# EAGLE design design (EAGLE 9.5.2)
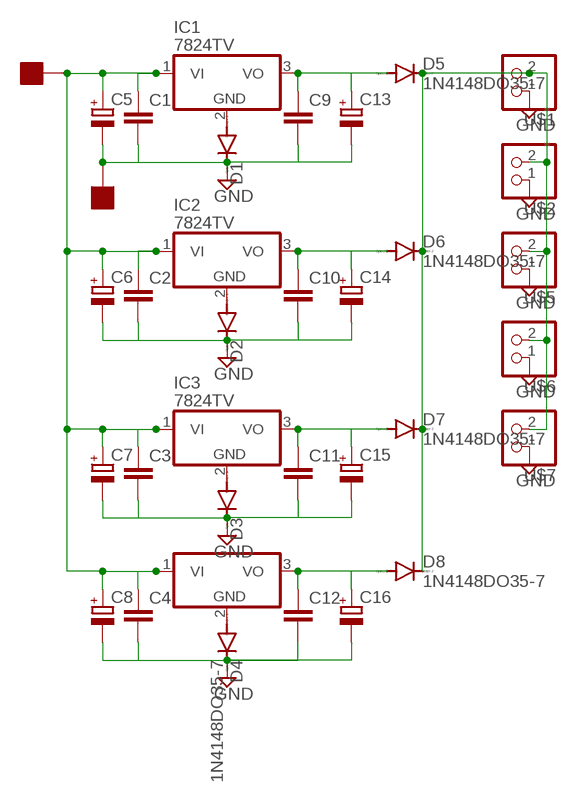
[diagram p0: schematic, sheet 1]

## Parts
C1  C-EU025-024X044  [C025-024X044]
C2  C-EU025-024X044  [C025-024X044]
C3  C-EU025-024X044  [C025-024X044]
C4  C-EU025-024X044  [C025-024X044]
C5  CPOL-EUE2.5-7  [E2,5-7]
C6  CPOL-EUE2.5-7  [E2,5-7]
C7  CPOL-EUE2.5-7  [E2,5-7]
C8  CPOL-EUE2.5-7  [E2,5-7]
C9  C-EU025-024X044  [C025-024X044]
C10  C-EU025-024X044  [C025-024X044]
C11  C-EU025-024X044  [C025-024X044]
C12  C-EU025-024X044  [C025-024X044]
C13  CPOL-EUE2.5-7  [E2,5-7]
C14  CPOL-EUE2.5-7  [E2,5-7]
C15  CPOL-EUE2.5-7  [E2,5-7]
C16  CPOL-EUE2.5-7  [E2,5-7]
D1  1N4148DO35-7  [DO35-7]
D2  1N4148DO35-7  [DO35-7]
D3  1N4148DO35-7  [DO35-7]
D4  1N4148DO35-7  [DO35-7]
D5  1N4148DO35-7  [DO35-7]
D6  1N4148DO35-7  [DO35-7]
D7  1N4148DO35-7  [DO35-7]
D8  1N4148DO35-7  [DO35-7]
IC1  7824TV  [TO220V]
IC2  7824TV  [TO220V]
IC3  7824TV  [TO220V]
IC4  7824TV  [TO220V]
U$1  ABOUTERS_2PIN  [22-23-2021]
U$2  ABOUTERS_2PIN  [22-23-2021]
U$3  PLAT10.0X10.0  [PLAT]
U$4  PLAT10.0X10.0  [PLAT]
U$5  ABOUTERS_2PIN  [22-23-2021]
U$6  ABOUTERS_2PIN  [22-23-2021]
U$7  ABOUTERS_2PIN  [22-23-2021]

## Nets
GND: C1.2 C2.2 C3.2 C4.2 C5.- C6.- C7.- C8.- C9.2 C10.2 C11.2 C12.2 C13.- C14.- C15.- C16.- D1.C D2.C D3.C D4.C U$1.1 U$2.1 U$4.P$1(RE) U$5.1 U$6.1 U$7.1
N$1: D1.A IC1.2(GND)
N$2: D2.A IC2.2(GND)
N$3: D3.A IC3.2(GND)
N$4: D4.A IC4.2(GND)
N$5: C11.1 C15.+ D7.A IC3.3(VO)
N$6: C1.1 C2.1 C3.1 C4.1 C5.+ C6.+ C7.+ C8.+ IC1.1(VI) IC2.1(VI) IC3.1(VI) IC4.1(VI) U$3.P$1(RE)
N$8: C10.1 C14.+ D6.A IC2.3(VO)
N$10: C9.1 C13.+ D5.A IC1.3(VO)
N$12: C12.1 C16.+ D8.A IC4.3(VO)
N$17: D5.C D6.C D7.C D8.C U$1.2 U$2.2 U$5.2 U$6.2 U$7.2

## Library data of the parts
C1-C4 C9-C12 = rcl:C-EU: CAPACITOR, European symbol; SPICEPREFIX: C
C5-C8 C13-C16 = rcl:CPOL-EU: POLARIZED CAPACITOR, European symbol; SPICEPREFIX: C
D1-D8 = diode:1N4148: DIODE high speed (Philips)
IC1-IC4 = linear:78*: Positive VOLTAGE REGULATOR Source: http://cache.national.com/ds/LM/LM78L05.pdf http://www.fairchildsemi.com/ds/LM/LM7805.pdf
U$1 U$2 U$5-U$7 = abouters_pin (1):ABOUTERS_2PIN
U$3 U$4 = plat10-10:PLAT10.0X10.0

## Board
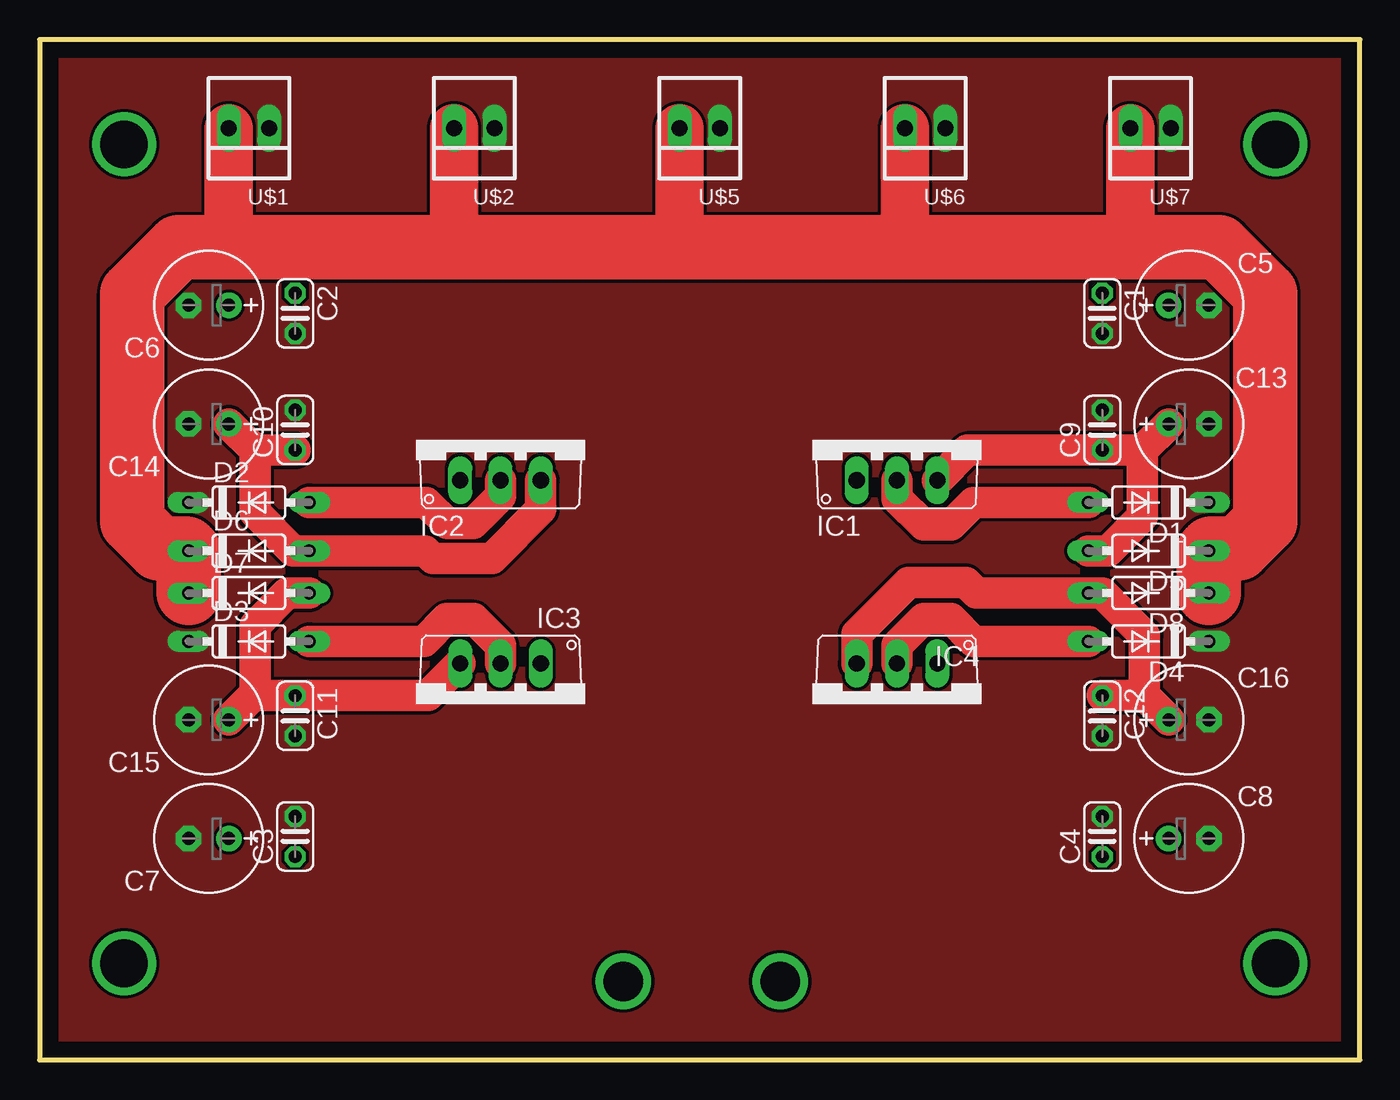
[diagram p1: board, top side]
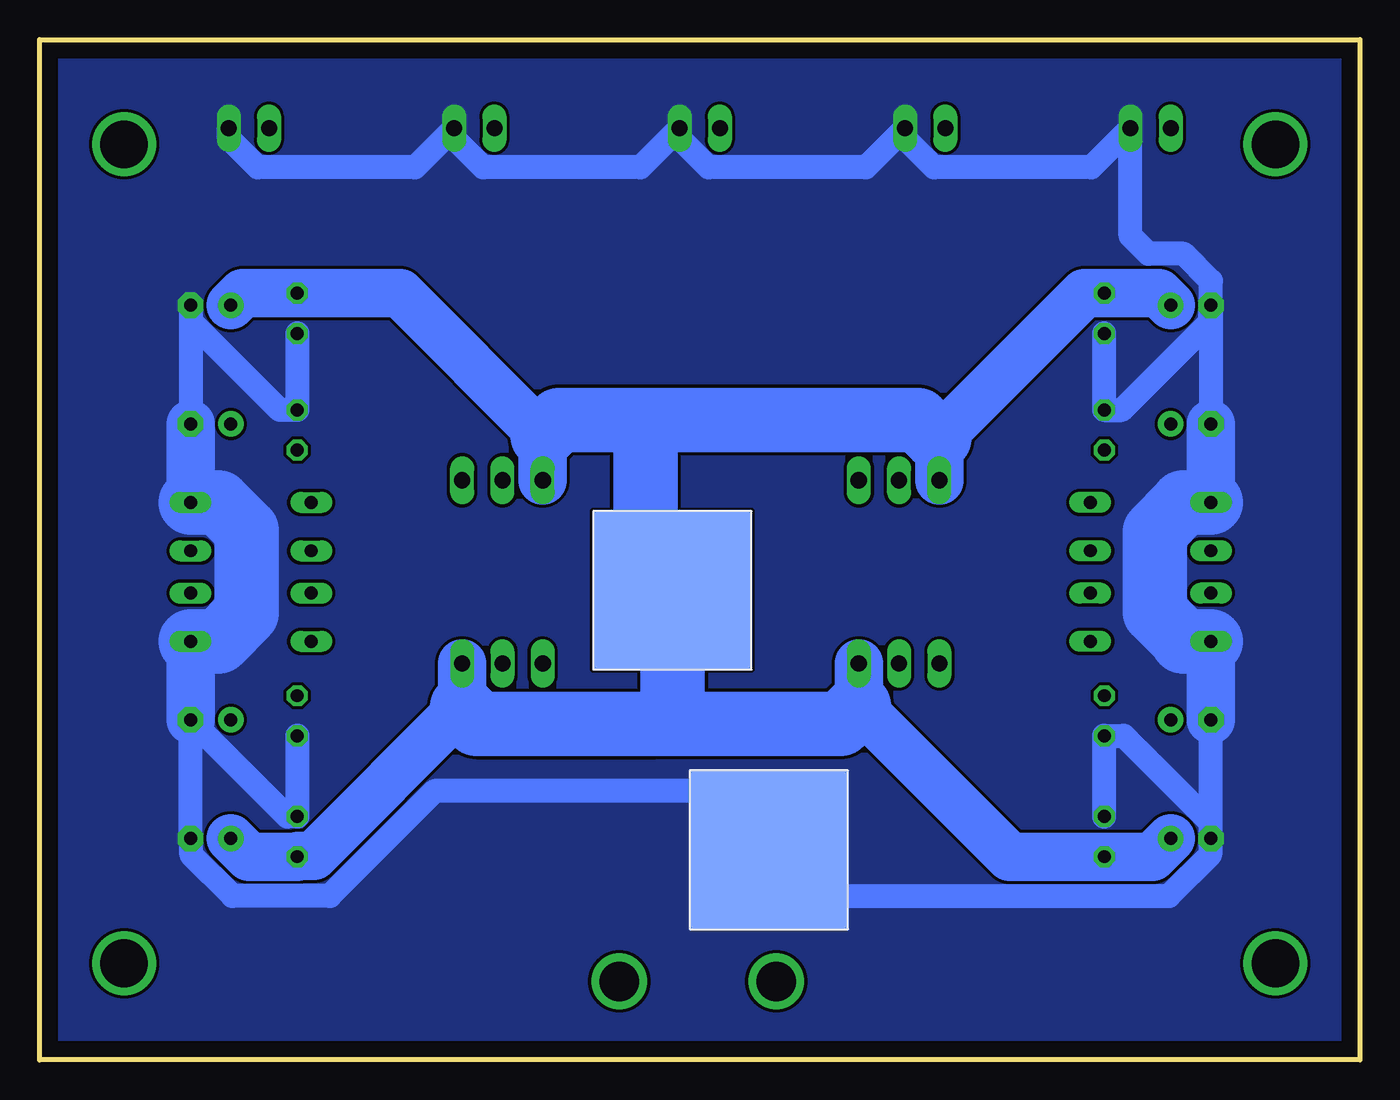
[diagram p2: board, bottom side, seen from below]

Size 83.31 x 64.39 mm. Coordinates in mm from the lower left corner, seen from the top.
Outline: 0,64.39 0,0 83.31,0 83.31,64.39 0,64.39
Copper layers (1*16): Top 0.035mm / dielectric 1.5mm / Bottom 0.035mm
Design rules "default *": minimum track width 6mil, minimum drill 0.35mm, track to track 0.2mm, track to pad 0.2mm, pad to pad 0.2mm, via to via 0.2mm, smd to smd 0.2mm, copper to edge 40mil, drill to drill 6mil, minimum pad ring 10mil, minimum via ring 8mil, stop-mask expansion 4mil, vias tented up to drill 0mil, thermal gap 10mil

### Footprints (pad centres in the part's own frame; a part is rotated, then mirrored left to right if it is on the bottom)
C025-024X044 = drill 0.813 octagon: 1 -1.27,0; 2 1.27,0
E2,5-7 = drill 0.813 pad 1.6: + -1.27,0 | drill 0.813 pad 1.6 octagon: - 1.27,0
DO35-7 = drill 0.813 long: A 3.81,0; C -3.81,0
TO220V = drill 1.016 long: 1 -2.54,-2.54; 2 0,-2.54; 3 2.54,-2.54
22-23-2021 = drill 1 long: 1 -1.27,0; 2 1.27,0
PLAT = smd 10 x 10: P$1 5,5

### Placement (x,y rotation side)
C1  67.06,47.12 270 top
C2  16.13,47.12 270 top
C3  16.13,14.1 90 top
C4  67.06,14.1 90 top
C5  72.52,47.62 0 top
C6  10.67,47.62 180 top
C7  10.67,13.97 180 top
C8  72.52,13.97 0 top
C9  67.06,39.75 90 top
C10  16.13,39.75 90 top
C11  16.13,21.72 270 top
C12  67.06,21.72 270 top
C13  72.52,40.13 0 top
C14  10.67,40.13 180 top
C15  10.67,21.46 180 top
C16  72.52,21.46 0 top
D1  69.98,35.18 180 top
D2  13.21,35.18 0 top
D3  13.21,26.42 0 top
D4  69.98,26.42 180 top
D5  69.98,32.13 180 top
D6  13.21,32.13 0 top
D7  13.21,29.46 0 top
D8  69.98,29.46 180 top
IC1  54.1,39.12 0 top
IC2  29.08,39.12 0 top
IC3  29.08,22.48 180 top
IC4  54.1,22.48 180 top
U$1  13.21,58.8 180 top
U$2  27.43,58.8 180 top
U$3  48.39,24.64 0 bottom
U$4  42.29,8.25 0 bottom
U$5  41.66,58.8 180 top
U$6  55.88,58.8 180 top
U$7  70.1,58.8 180 top

### Tracks (layer width: path | path; a pad name or v marks a point on that pad's centre or on a via)
GND
  Bottom 1.524: C15.- C7.- 9.45,13.92 | C3.2 C11.2 14.9,20.45 9.45,15 9.45,13.92 | C1.2 C9.2 68.16,41.02 73.73,46.59 73.73,47.57 C5.- C13.- | C12.2 C4.2 67.69,15.37 C16.- C8.- 73.73,13.92 73.73,12.94 71.13,10.34 65.01,10.34 58.38,16.98 41.01,16.98 U$4.P$1 34.38,10.34 12.05,10.34 9.45,12.94 9.45,13.92 | C6.- C14.- | C2.2 C10.2 15.03,41.02 9.45,46.59 9.45,47.57 C6.- | C6.- 9.4,49.15 11.12,50.87 13.34,50.87 14.48,52.02 U$1.1 16.95,56.33 26.87,56.33 28.7,58.16 U$2.1 31.17,56.33 41.1,56.33 42.93,58.16 U$5.1 45.4,56.33 55.32,56.33 57.15,58.16 U$6.1 59.62,56.33 69.54,56.33 71.37,58.16 U$7.1
  Bottom 3.048: D2.C C14.- | C15.- D3.C | C16.- D4.C | D1.C C13.-
  Bottom 4.064: D3.C 11.18,26.42 11.18,26.49 12.95,28.27 12.95,33.33 11.18,35.1 11.18,35.18 D2.C | D4.C 72.01,26.42 70.23,28.19 70.23,33.4 72.01,35.18 D1.C
  pour Top (no thermals): -0.13,64.52 -0.13,-0.13 83.44,-0.13 83.44,64.52
  pour Bottom (no thermals): -0.13,64.52 -0.13,-0.13 83.44,-0.13 83.44,64.52
N$1
  Top 2: D1.A 58.92,35.18 57.5,33.75 55.79,33.75 54.1,35.44 IC1.2
N$2
  Top 2: D2.A 24.4,35.18 25.73,33.85 27.36,33.85 29.08,35.58 IC2.2
N$3
  Top 2: D3.A 24.26,26.42 25.69,27.84 27.4,27.84 29.08,26.16 IC3.2
N$4
  Top 2: IC4.2 54.1,26.16 55.79,27.84 57.5,27.84 58.92,26.42 D4.A
N$5
  Top 2: C15.+ 13.46,22.99 | 13.46,22.99 C11.1 24.51,22.99 IC3.3 | 13.46,22.99 13.59,23.11 13.59,27.43 15.62,29.46 D7.A
N$6
  Bottom 3.048: C6.+ 12.7,48.39 C2.1 17.4,48.39 26.54,39.24 IC2.1 | C7.+ 13.08,12.83 C3.1 22.1,12.83 31.62,22.35 IC3.1 | C8.+ 70.1,12.83 C4.1 67,12.88 66.03,12.88 56.64,22.27 IC4.1 | C5.+ 70.49,48.39 C1.1 60.58,48.39 51.56,39.37 IC1.1
  Bottom 4.064: 31.62,22.35 32.77,21.21 44.45,21.21 | 26.54,39.24 26.75,39.24 27.9,40.39 45.09,40.39 | 45.09,40.39 50.55,40.39 51.56,39.37 | 44.45,21.21 55.75,21.21 55.75,21.38 56.64,22.27 | 44.45,21.21 43.39,22.27 U$3.P$1 45.09,31.34 45.09,40.39
N$7  (via drill 2.5)
  other vias: 36.83,4.95
N$8
  Top 2: C14.+ 13.59,38.48 | 13.59,38.48 C10.1 | 13.59,38.48 13.59,34.54 16,32.13 D6.A 24.34,32.13 24.82,31.65 28.55,31.65 31.62,34.72 IC2.3
N$9  (via drill 2.5)
  other vias: 46.74,4.95
N$10
  Top 2: D5.A 67.44,32.13 69.6,34.29 69.6,38.48 | IC1.3 58.55,38.48 C9.1 69.6,38.48 | C13.+ 69.6,38.48
N$11  (via drill 3)
  other vias: 5.33,6.1
N$12
  Top 2: C16.+ 69.72,22.99 | C12.1 69.72,22.99 | 69.72,22.99 69.72,26.8 67.06,29.46 D8.A 59.13,29.46 58.45,30.14 54.84,30.14 51.56,26.87 IC4.3
N$14  (via drill 3)
  other vias: 77.98,6.1
N$15  (via drill 3)
  other vias: 77.98,57.78
N$16  (via drill 3)
  other vias: 5.33,57.78
N$17
  Top 3.048: U$1.2 11.94,57.78 | 11.94,57.78 11.94,51.28 | U$2.2 26.16,51.28 | U$5.2 40.39,51.28 | U$6.2 54.61,51.41 54.74,51.28 | U$7.2 68.83,51.41 68.96,51.28 | 11.94,57.78
  Top 4.064: D7.C D6.C 9.24,32.29 7.54,32.29 5.85,33.98 5.85,48.36 8.76,51.28 11.94,51.28 26.16,51.28 40.39,51.28 54.74,51.28 68.96,51.28 74.42,51.28 77.34,48.36 77.34,33.98 75.65,32.29 73.94,32.29 D5.C D8.C